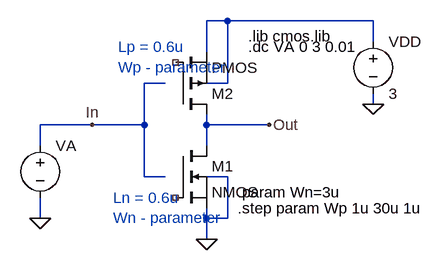
[diagram p0: schematic inv-sym.asc]
inv-sym.asc, the LTspice schematic file:
Version 4
SHEET 1 1292 680
WIRE -592 -96 -624 -96
WIRE -368 -96 -592 -96
WIRE -368 -64 -368 -96
WIRE -624 -48 -624 -96
WIRE -688 0 -720 0
WIRE -592 0 -592 -96
WIRE -592 0 -624 0
WIRE -368 32 -368 16
WIRE -800 64 -880 64
WIRE -720 64 -720 0
WIRE -720 64 -800 64
WIRE -624 64 -624 48
WIRE -528 64 -624 64
WIRE -880 96 -880 64
WIRE -624 96 -624 64
WIRE -720 144 -720 64
WIRE -688 144 -720 144
WIRE -592 144 -624 144
WIRE -880 208 -880 176
WIRE -624 208 -624 192
WIRE -592 208 -592 144
WIRE -592 208 -624 208
WIRE -624 240 -624 208
FLAG -624 240 0
FLAG -368 32 0
FLAG -800 64 In
FLAG -528 64 Out
FLAG -880 208 0
SYMBOL voltage -368 -80 R0
WINDOW 123 0 0 Left 2
WINDOW 39 0 0 Left 2
SYMATTR InstName VDD
SYMATTR Value 3
SYMBOL voltage -880 80 R0
WINDOW 123 0 0 Left 2
WINDOW 39 0 0 Left 2
SYMATTR InstName VA
SYMATTR Value ""
SYMBOL pmos -672 48 M180
WINDOW 39 56 100 Left 2
WINDOW 40 56 128 Left 2
SYMATTR InstName M2
SYMATTR Value2 l=0.6u w={Wp}
SYMATTR SpiceModel ""
SYMATTR Value PMOS
SYMBOL nmos -672 96 R0
SYMATTR InstName M1
SYMATTR Value2 l=0.6u w={Wn}
SYMATTR Value NMOS
TEXT -560 -72 Left 2 !.lib cmos.lib
TEXT -560 -56 Left 2 !.dc VA 0 3 0.01
TEXT -576 192 Left 2 !.step param Wp 1u 30u 1u
TEXT -760 -56 Left 2 ;Lp = 0.6u\nWp - parameter
TEXT -768 176 Left 2 ;Ln = 0.6u\nWn - parameter
TEXT -576 168 Left 2 !.param Wn=3u

The netlist it stands for:
* inv-sym.asc
VDD N001 0 3
VA In 0
* M2: PMOS l=0.6u w={Wp} (symbol pmos not certain, pin order unknown); nets seen at it: N001, Out
* M1: NMOS l=0.6u w={Wn} (symbol nmos not certain, pin order unknown); nets seen at it: 0, Out
.lib cmos.lib
.dc VA 0 3 0.01
.step param Wp 1u 30u 1u
* Lp = 0.6u
* Wp - parameter
* Ln = 0.6u
* Wn - parameter
.param Wn=3u
.backanno
.end